# Altium schematic sheet Sheet1.SchDoc
size A4
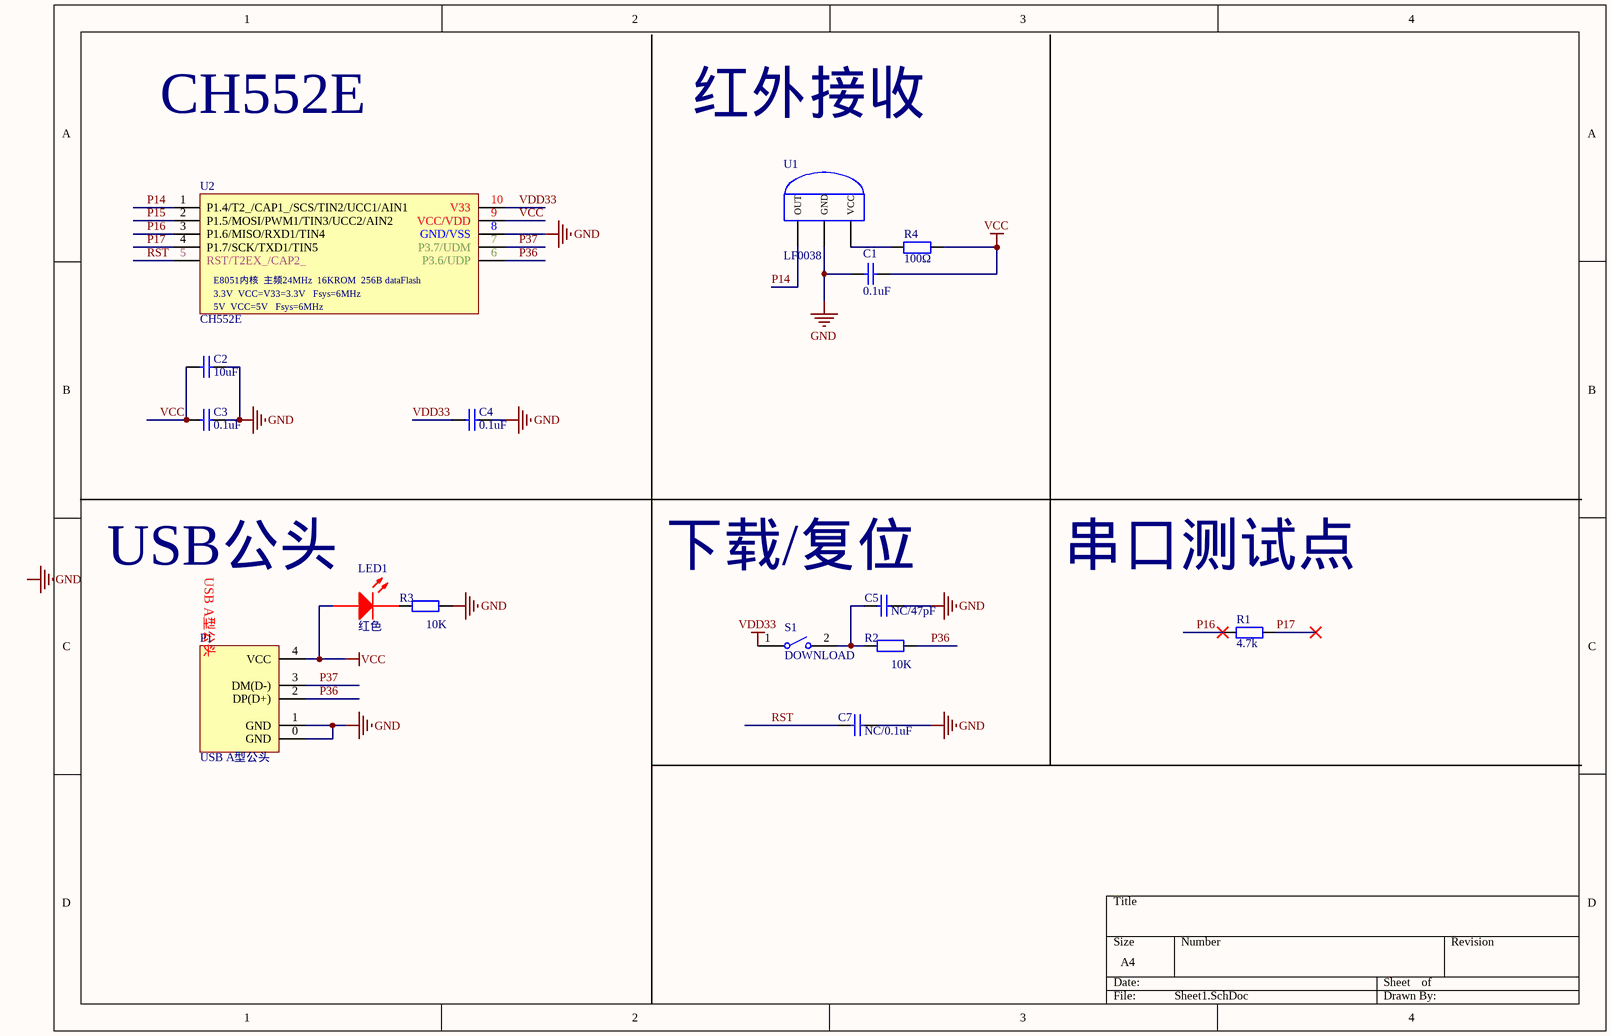
[diagram p0: Sheet1.SchDoc]

## Parts
C1  0.1uF  [0603_C]
C2  10uF  [0603_C]
C3  0.1uF  [0603_C]
C4  0.1uF  [0603_C]
C5  NC/47pF  [0603_C]
C7  NC/0.1uF  [0603_C]
LED1  红色  [0603_LED_RED]
P1  USB A型公头  [USB_A型公头双面插]
R1  4.7k  [0603_R]
R2  10K  [0603_R]
R3  10K  [0603_R]
R4  100Ω  [0603_R]
S1  DOWNLOAD  [Switch_3*4*2]
U1  LF0038  [4mm贴片红外接收头]
U2  CH552E  [MSOP-10]

## Nets
GND: C1.2 C2.2 C3.2 C4.2 C5.2 C7.2 P1.0(GND) P1.1(GND) R3.2 U1.2(GND) U2.8(GND/VSS)
VCC: C1.1 C2.1 C3.1 LED1.1 P1.4(VCC) R4.2 U2.9(VCC/VDD)
VDD33: C4.1 S1.1 U2.10(V33)
P14: U1.1(OUT) U2.1(P1.4/T2_/CAP1_/SCS/TIN2/UCC1/AIN1)
P15: U2.2(P1.5/MOSI/PWM1/TIN3/UCC2/AIN2)
P16: R1.1 U2.3(P1.6/MISO/RXD1/TIN4)
P17: R1.2 U2.4(P1.7/SCK/TXD1/TIN5)
P36: P1.2(DP(D+)) R2.2 U2.6(P3.6/UDP)
P37: P1.3(DM(D-)) U2.7(P3.7/UDM)
RST: C7.1 U2.5(RST/T2EX_/CAP2_)
NetC5_1: C5.1 R2.1 S1.2
NetLED1_2: LED1.2 R3.1
NetR4_1: R4.1 U1.3(VCC)

## Notes on the sheet
- CH552E
- 红外接收
- USB公头
- 下载/复位
- 串口测试点
- Labels drawn without touching a wire or pin: GND
- (in symbol CH552E MSOP10) E8051内核  主频24MHz  16KROM  256B dataFlash; 3.3V  VCC=V33=3.3V   Fsys=6MHz; 5V  VCC=5V   Fsys=6MHz

## Library data of the parts
C1-C5 C7 = Cap: Value: 100pF; Published: 8-Jun-2000; LatestRevisionDate: 17-Jul-2002; LatestRevisionNote: Re-released for DXP Platform.; PackageReference: RAD-0.3; Publisher: Altium Limited; PackageDescription: Radial Cap, Thru-Hole; 2 Leads; 0.3 in Pin Spacing
LED1 = LED_RED: Published: 8-Jun-2000; LatestRevisionDate: 08-Jul-2005; LatestRevisionNote: Mech Layer 1 removed.; PackageReference: LED-0; Publisher: Altium Limited; PackageDescription: LED; 2 Leads
R1-R4 = Res: 电阻; Value: 1K; Published: 8-Jun-2000; LatestRevisionDate: 17-Jul-2002; LatestRevisionNote: Re-released for DXP Platform.; PackageReference: AXIAL-0.4; Publisher: Altium Limited; PackageDescription: Axial Device, Thru-Hole; 2 Leads; 0.4 in Pin Spacing
S1 = Switch: Published: 24-Mar-1999; LatestRevisionDate: 17-Jul-2002; LatestRevisionNote: Re-released for DXP Platform.; PackageReference: SPST-2; Publisher: Altium Limited; PackageDescription: Switch; 2 Leads
U2 = CH552E MSOP10: 10-bit